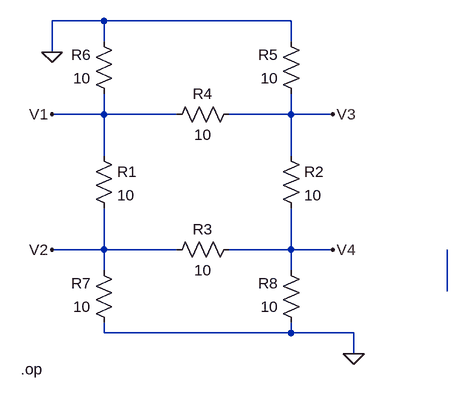
[diagram p0: schematic ejemplo5.asc]
ejemplo5.asc, the LTspice schematic file:
Version 4
SHEET 1 880 680
WIRE 128 -64 48 -64
WIRE 416 -64 128 -64
WIRE 128 -32 128 -64
WIRE 416 -32 416 -64
WIRE 48 -16 48 -64
WIRE 128 80 128 48
WIRE 128 80 48 80
WIRE 240 80 128 80
WIRE 416 80 416 48
WIRE 416 80 320 80
WIRE 480 80 416 80
WIRE 128 144 128 80
WIRE 416 144 416 80
WIRE 128 288 128 224
WIRE 128 288 48 288
WIRE 240 288 128 288
WIRE 416 288 416 224
WIRE 416 288 320 288
WIRE 480 288 416 288
WIRE 128 320 128 288
WIRE 416 320 416 288
WIRE 656 352 656 288
WIRE 128 416 128 400
WIRE 416 416 416 400
WIRE 416 416 128 416
WIRE 512 416 416 416
WIRE 512 448 512 416
FLAG 48 80 V1
FLAG 48 288 V2
FLAG 480 80 V3
FLAG 480 288 V4
FLAG 48 -16 0
FLAG 512 448 0
SYMBOL res 112 128 R0
SYMATTR InstName R1
SYMATTR Value 10
SYMBOL res 400 128 R0
SYMATTR InstName R2
SYMATTR Value 10
SYMBOL res 336 272 R90
WINDOW 0 0 56 VBottom 2
WINDOW 3 32 56 VTop 2
SYMATTR InstName R3
SYMATTR Value 10
SYMBOL res 336 64 R90
WINDOW 0 0 56 VBottom 2
WINDOW 3 32 56 VTop 2
SYMATTR InstName R4
SYMATTR Value 10
SYMBOL res 432 64 R180
WINDOW 0 36 76 Left 2
WINDOW 3 36 40 Left 2
SYMATTR InstName R5
SYMATTR Value 10
SYMBOL res 144 64 R180
WINDOW 0 36 76 Left 2
WINDOW 3 36 40 Left 2
SYMATTR InstName R6
SYMATTR Value 10
SYMBOL res 144 416 R180
WINDOW 0 36 76 Left 2
WINDOW 3 36 40 Left 2
SYMATTR InstName R7
SYMATTR Value 10
SYMBOL res 432 416 R180
WINDOW 0 36 76 Left 2
WINDOW 3 36 40 Left 2
SYMATTR InstName R8
SYMATTR Value 10
TEXT 0 472 Left 2 !.op

The netlist it stands for:
* ejemplo5.asc
R1 V1 V2 10
R2 V3 V4 10
R3 V4 V2 10
R4 V3 V1 10
R5 V3 0 10
R6 V1 0 10
R7 0 V2 10
R8 0 V4 10
.op
.backanno
.end